# Altium project mbed_main_board.PrjPcb
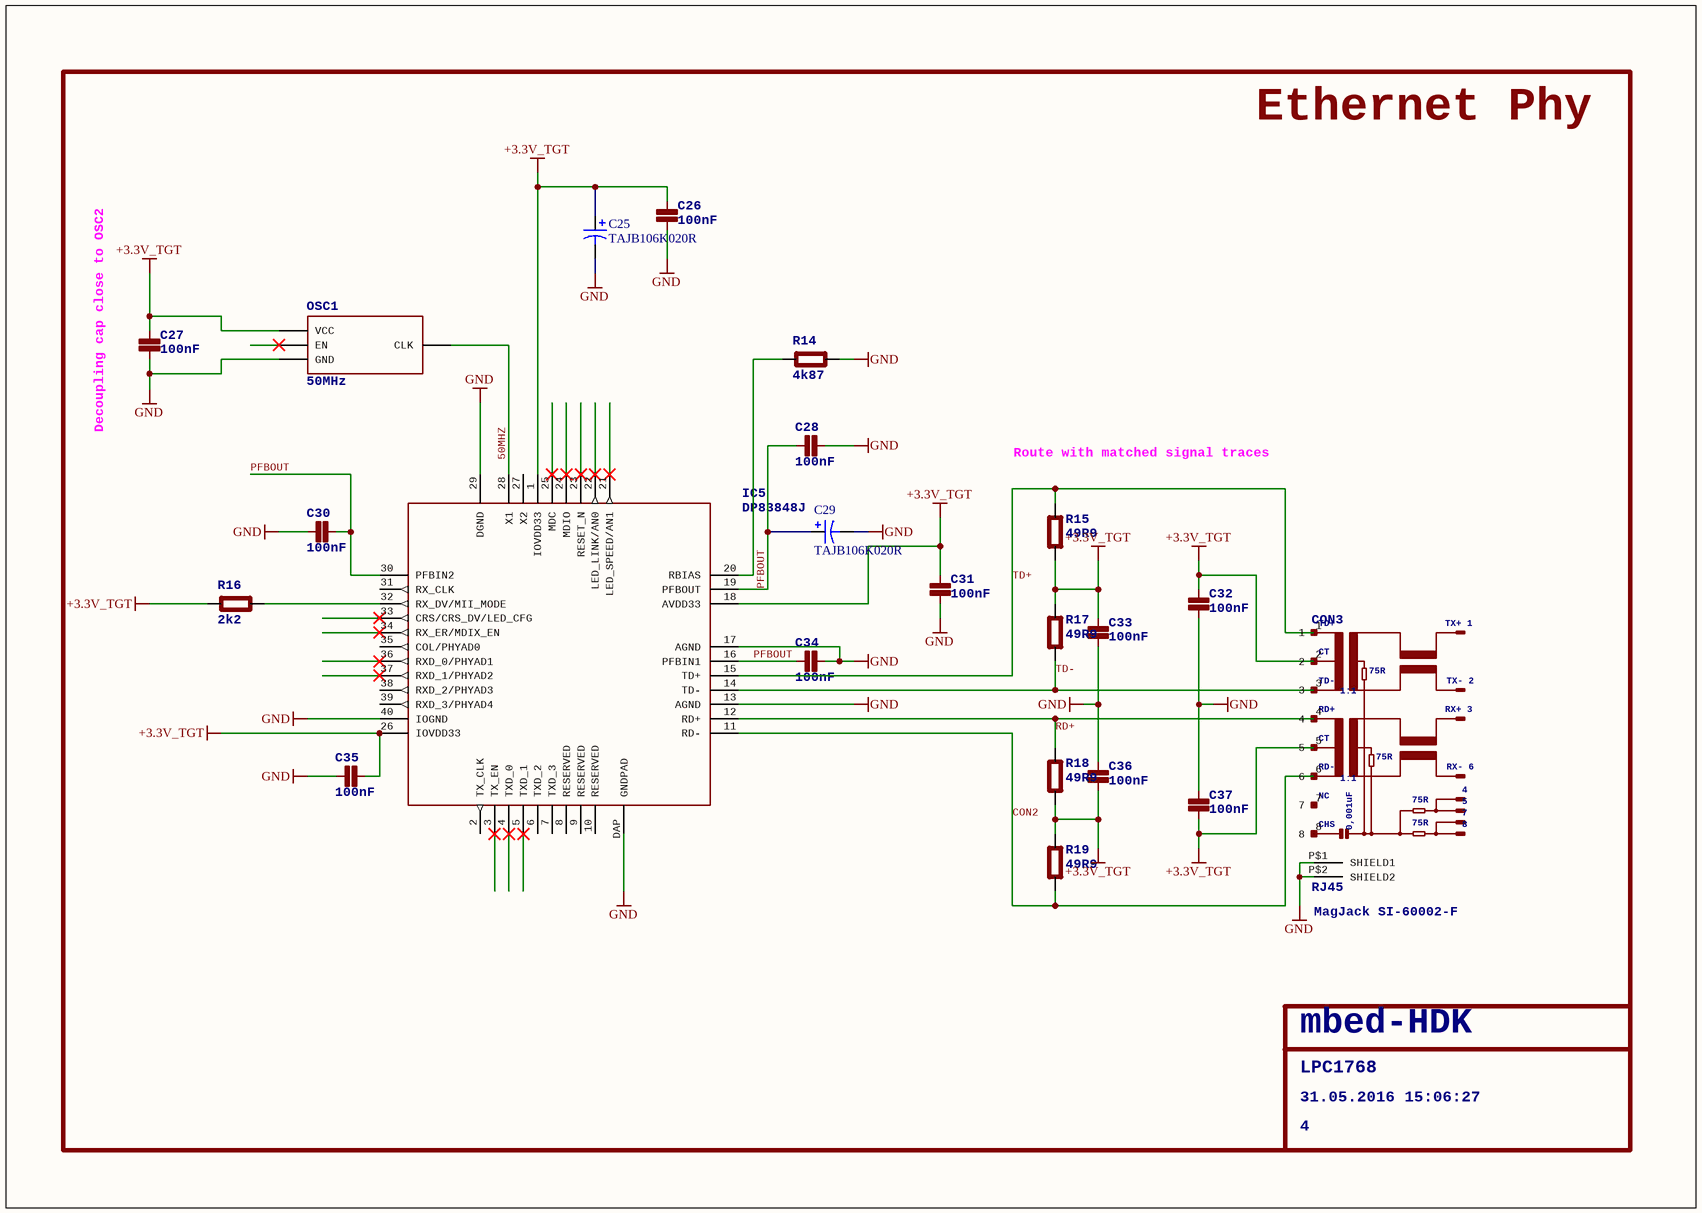
[diagram p0: ethernet_module.SchDoc]
5 sheets, 84 parts. Net scope: global (net labels, ports and power ports of the same name join across sheets).
Sheets:
  ethernet_module.SchDoc
  programming_module.SchDoc
  mbed_main_board.SchDoc
    U_LPC1768 = LPC1768.SchDoc
    U_usb = usb.SchDoc

## Sheet ethernet_module.SchDoc: LPC1768
size 298 x 212 mm; Date: 31.05.2016 15:06:27; SheetNumber: 4

### Parts
C25  TAJB106K020R  [AVX-CAPC3528_V]
C26  100nF  [0603]
C27  100nF  [0603]
C28  100nF  [0603]
C29  TAJB106K020R  [AVX-CAPC3528_V]
C30  100nF  [0603]
C31  100nF  [0603]
C32  100nF  [0603]
C33  100nF  [0603]
C34  100nF  [0603]
C35  100nF  [0603]
C36  100nF  [0603]
C37  100nF  [0603]
CON3  RJ45  RX+3: RX+ 3  TX-2: TX- 2  TX+1: TX+ 1  RX-6: RX- 6  MagJackSI-60002-F: MagJack SI-60002-F  [RJ45]
IC5  DP83848J  [LLP-40]
OSC1  50MHz  [3.2X.2.5]
R14  4k87  [0603]
R15  49R9  [0603]
R16  2k2  [0603]
R17  49R9  [0603]
R18  49R9  [0603]
R19  49R9  [0603]

### Nets
+3.3V_TGT: C25.1 C26.1(P$1) C27.1(P$1) C31.1(P$1) C32.1(P$1) C33.1(P$1) C35.1(P$1) C36.2(P$2) C37.2(P$2) CON3.2 CON3.5 IC5.1(IOVDD33) IC5.18(AVDD33) IC5.26(IOVDD33) OSC1.P$4(VCC) R15.1(P$1) R16.1(P$1) R17.2(P$2) R18.1(P$1) R19.2(P$2)
GND: C25.2 C26.2(P$2) C27.2(P$2) C28.1(P$1) C29.2 C30.1(P$1) C31.2(P$2) C32.2(P$2) C33.2(P$2) C34.2(P$2) C35.2(P$2) C36.1(P$1) C37.1(P$1) CON3.P$1(SHIELD1) CON3.P$2(SHIELD2) IC5.13(AGND) IC5.17(AGND) IC5.29(DGND) IC5.40(IOGND) IC5.DAP(GNDPAD) OSC1.P$2(GND) R14.1(P$1)
50MHZ: IC5.28(X1) OSC1.P$3(CLK)
CON2: CON3.6 IC5.11(RD-) R19.1(P$1)
PFBOUT: C28.2(P$2) C29.1 C30.2(P$2) C34.1(P$1) IC5.16(PFBIN1) IC5.19(PFBOUT) IC5.30(PFBIN2)
RD+: CON3.4 IC5.12(RD+) R18.2(P$2)
TD+: CON3.1 IC5.15(TD+) R15.2(P$2)
TD-: CON3.3 IC5.14(TD-) R17.1(P$1)
NetIC5_20: IC5.20(RBIAS) R14.2(P$2)
NetIC5_32: IC5.32(RX_DV/MII_MODE) R16.2(P$2)

Not connected (* = marked no-connect by the designer): CON3 7 8; IC5 2(TX_CLK) 3(TX_EN)* 4(TXD_0)* 5(TXD_1)* 6(TXD_2) 7(TXD_3) 8(RESERVED) 9(RESERVED) 10(RESERVED) 21(LED_SPEED/AN1)* 22(LED_LINK/AN0)* 23(RESET_N)* 24(MDIO)* 25(MDC)* 27(X2) 31(RX_CLK) 33(CRS/CRS_DV/LED_CFG)* 34(RX_ER/MDIX_EN)* 35(COL/PHYAD0) 36(RXD_0/PHYAD1)* 37(RXD_1/PHYAD2)* 38(RXD_2/PHYAD3) 39(RXD_3/PHYAD4); OSC1 P$1(EN)*

### Notes on the sheet
- Ethernet Phy
- (near C27) Decoupling cap close to OSC2
- (near R15) Route with matched signal traces
- LPC1768
- mbed-HDK
- 31.05.2016 15:06:27
- 4

### Library data of the parts
C25 C29 = CMP-0279-00001-1: Capacitor, Tantalum, 10uF 10% 20V MCCT-B (3528); Manufacturer: AVX; Polarity: Polarized; PartNumber: TAJB106K020R; PackageDescription: 2-Pin SMT Capacitor, 3.5 x 2.8 mm Body; ComponentLink1URL: http://www.avx.com/; PackageReference: CAPC3528; ComponentLink2Description: Datasheet; Capacitance: 10uF; Technology: Tantalum; ComponentLink2URL: http://www.avx.com/docs/Catalogs/taj.pdf; Tolerance: 10%; ComponentLink1Description: Manufacturer URL; Rated Voltage: 20V; DatasheetVersion: Jun-13; Mounting Technology: Surface Mount
C26-C28 C30-C37 = C0603
CON3 = RJ45: Magjack SI-68002; 75R: 75R; TD+: TD+; CT: CT; TD-: TD-; RD+: RD+; RD-: RD-; NC: NC; CHS: CHS; 0,001uF: 0,001uF; 4: 4; 5: 5; 7: 7; 8: 8; 1:1: 1:1
IC5 = DP83848J: National Semiconductor DP83848J PHYTER Mini LS Single Port 10/100 Ethernet Transceiver
OSC1 = OSCILLATOR
R14-R19 = R0603

## Sheet programming_module.SchDoc: LPC1768
size 298 x 212 mm; Date: 31.05.2016 15:06:24; SheetNumber: 1
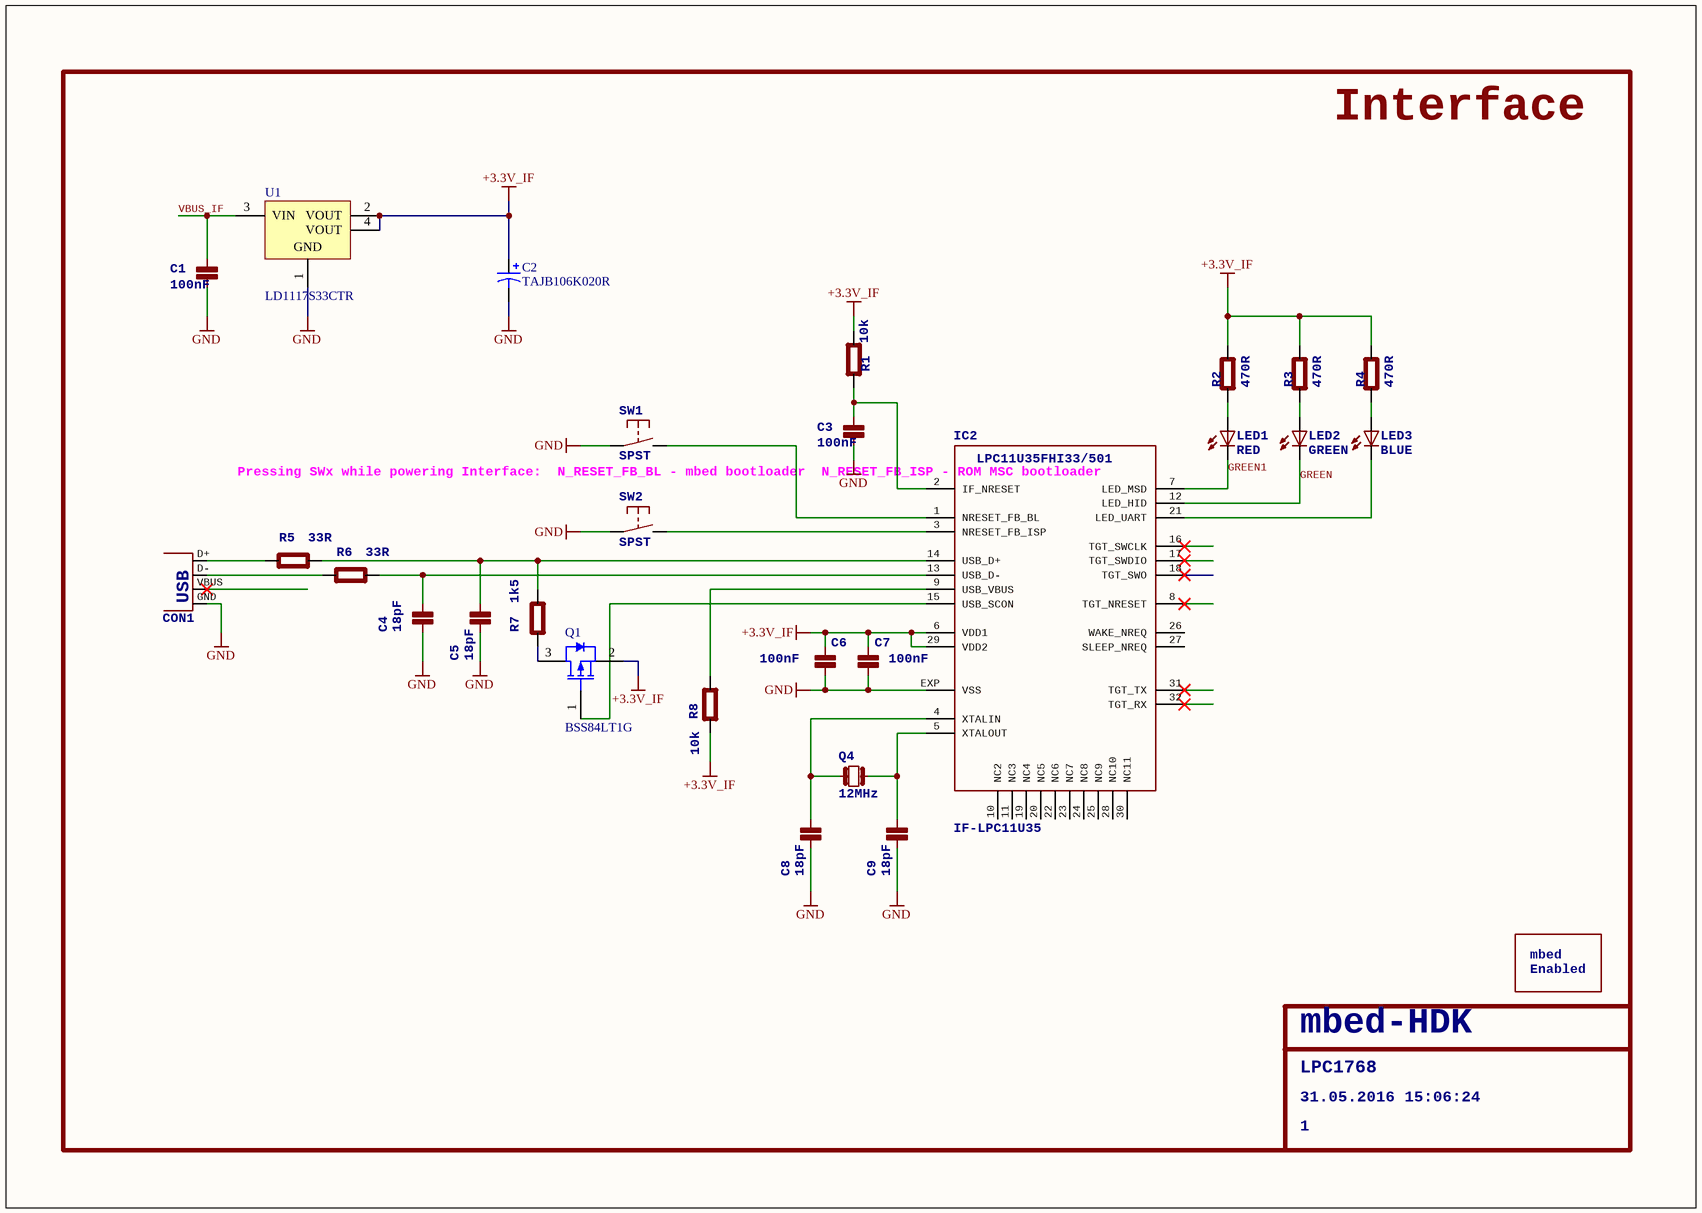
[diagram p1: programming_module.SchDoc]

### Parts
C1  100nF  [0603]
C2  TAJB106K020R  [AVX-CAPC3528_V]
C3  100nF  [0603]
C4  18pF  [0603]
C5  18pF  [0603]
C6  100nF  [0603]
C7  100nF  [0603]
C8  18pF  [0603]
C9  18pF  [0603]
CON1  USB-MB-S  [USB-MB-S]  (value not drawn)
IC2  IF-LPC11U35  [HVQFN33]
LED1  RED  [CHIPLED_0603]
LED2  GREEN  [CHIPLED_0603]
LED3  BLUE  [CHIPLED_0603]
Q1  BSS84LT1G  [ONSC-SOT-23-3-318-08_V]
Q4  12MHz  [HC49UP]
R1  10k  [0603]
R2  470R  [0603]
R3  470R  [0603]
R4  470R  [0603]
R5  33R  [0603]
R6  33R  [0603]
R7  1k5  [0603]
R8  10k  [0603]
SS1  MBED-ENABLED-LOGOMEDIUM  [MBED-ENABLED-LOGO-500X500-MIL]  (value not drawn)
SW1  SPST  [DTSM-32S-B]
SW2  SPST  [DTSM-32S-B]
U1  LD1117S33CTR  [SOT-223_N]

### Nets
+3.3V_IF: C2.1 C6.1(P$1) C7.1(P$1) IC2.6(VDD1) IC2.29(VDD2) Q1.2(S) R1.2(P$2) R2.1(P$1) R3.1(P$1) R4.1(P$1) R8.2(P$2) U1.2(VOUT) U1.4(VOUT)
GND: C1.2(P$2) C2.2 C3.2(P$2) C4.2(P$2) C5.2(P$2) C6.2(P$2) C7.2(P$2) C8.2(P$2) C9.2(P$2) CON1.GND IC2.EXP(VSS) SW1.P$1(P) SW2.P$1(P) U1.1(GND)
GREEN: IC2.12(LED_HID) LED2.C
GREEN1: IC2.7(LED_MSD) LED1.C
VBUS_IF: C1.1(P$1) U1.3(VIN)
NetC3_1: C3.1(P$1) IC2.2(IF_NRESET) R1.1(P$1)
NetC4_1: C4.1(P$1) IC2.13(USB_D-) R6.2(P$2)
NetC5_1: C5.1(P$1) IC2.14(USB_D+) R5.2(P$2) R7.2(P$2)
NetC8_1: C8.1(P$1) IC2.4(XTALIN) Q4.1
NetC9_1: C9.1(P$1) IC2.5(XTALOUT) Q4.2
NetCON1_D+: CON1.D+ R5.1(P$1)
NetCON1_D-: CON1.D- R6.1(P$1)
NetIC2_1: IC2.1(NRESET_FB_BL) SW1.P$2(S)
NetIC2_3: IC2.3(NRESET_FB_ISP) SW2.P$2(S)
NetIC2_9: IC2.9(USB_VBUS) R8.1(P$1)
NetIC2_15: IC2.15(USB_SCON) Q1.1(G)
NetIC2_21: IC2.21(LED_UART) LED3.C
NetLED1_A: LED1.A R2.2(P$2)
NetLED2_A: LED2.A R3.2(P$2)
NetLED3_A: LED3.A R4.2(P$2)
NetQ1_3: Q1.3(D) R7.1(P$1)

Not connected (* = marked no-connect by the designer): CON1 VBUS*; IC2 8(TGT_NRESET)* 10(NC2) 11(NC3) 16(TGT_SWCLK)* 17(TGT_SWDIO)* 18(TGT_SWO)* 19(NC4) 20(NC5) 22(NC6) 23(NC7) 24(NC8) 25(NC9) 26(WAKE_NREQ) 27(SLEEP_NREQ) 28(NC10) 30(NC11) 31(TGT_TX)* 32(TGT_RX)*

### Notes on the sheet
- Interface
- (near IC2) Pressing SWx while powering Interface:
  N_RESET_FB_BL - mbed bootloader
  N_RESET_FB_ISP - ROM MSC bootloader
- LPC1768
- mbed-HDK
- 31.05.2016 15:06:24
- 1

### Library data of the parts
C1 C3-C9 = C0603
C2 = CMP-0279-00001-1: as C25 on sheet ethernet_module; PartNumber: TAJB106K020R; PackageDescription: 2-Pin SMT Capacitor, 3.5 x 2.8 mm Body; ComponentLink1URL: http://www.avx.com/; PackageReference: CAPC3528; ComponentLink2Description: Datasheet; Capacitance: 10uF; Technology: Tantalum; ComponentLink2URL: http://www.avx.com/docs/Catalogs/taj.pdf; Tolerance: 10%; ComponentLink1Description: Manufacturer URL; Rated Voltage: 20V; DatasheetVersion: Jun-13; Mounting Technology: Surface Mount
CON1 = USB-MB-S: USB Connectors; USB: USB
LED1-LED3 = LED0603
Q1 = CMP-1058-00762-1: Power MOSFET Single P-Channel, -50 V, 10 Ohm, 3-Pin SOT-23, Pb-Free, Tape and Reel; Manufacturer: On Semiconductor; Ciss Typ (pF): 36; ID Max (A): 0.13; Channel Polarity: P Channel; VGS(th) Max (V): 2; VGS Max (V): 20; V(BR)DSS Min (V): 50; Crss Typ (pF): 6.5; PD Max (W): 0.225; Coss Typ (pF): 17; Configuration: Single; Mounting Technology: Surface Mount; ComponentLink3URL: http://www.onsemi.cn/pub_link/Collateral/318-08.PDF; ComponentLink1Description: Manufacturer URL; Package Type: SOT-23-3; ComponentLink2URL: http://www.onsemi.com/pub_link/Collateral/BSS84LT1-D.PDF; RoHS: Pb-Free; Packing: Tape and Reel; ComponentLink1URL: http://www.onsemi.com/; PackageVersion: Rev. AP, 11/2009; PackageReference: SOT-23-3-318-08; PackageDescription: 3-Pin Small Outline Transistor, Body 2.92 x 1.3 mm, Pitch 0.95 mm; DatasheetVersion: Rev. 8; ComponentLink3Description: Package Specification; PartNumber: BSS84LT1G; ComponentLink2Description: Datasheet
Q4 = Q_HC49UP
R1-R8 = R0603
U1 = CMP-0244-00307-1: Fixed Low Drop Positive Voltage Regulator, 3.3V, 4-Pin SOT-223, Tape and Reel; ComponentLink1URL: http://www.st.com; PackageVersion: 2010; ComponentLink1Description: Manufacturer URL; DatasheetVersion: 1/11/2011; ComponentLink2URL: http://www.st.com/internet/com/TECHNICAL_RESOURCES/TECHNICAL_LITERATURE/DATASHEET/CD00000544.pdf; PackageReference: SOT-223; ComponentLink2Description: Datasheet; PackageDescription: 4-Pin SOT-223 Package, 6.5 x 3.5 mm Body, 2.3 mm Pitch, 7 mm Lead Span
IC2 = IF-LPC11U35: LPC11U35FHI33/501: LPC11U35FHI33/501
SS1 = MBED-ENABLED-LOGOMEDIUM: mbed: mbed; Enabled: Enabled

## Sheet mbed_main_board.SchDoc
size A4
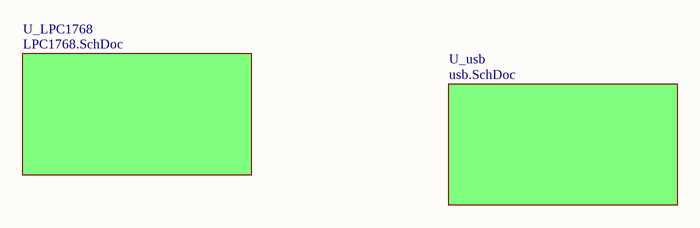
[diagram p2: mbed_main_board.SchDoc]

### Sub-sheets
U_LPC1768 = LPC1768.SchDoc: no entries
U_usb = usb.SchDoc: no entries

## Sheet LPC1768.SchDoc: LPC1768
size 298 x 212 mm; Date: 31.05.2016 15:06:25; SheetNumber: 2
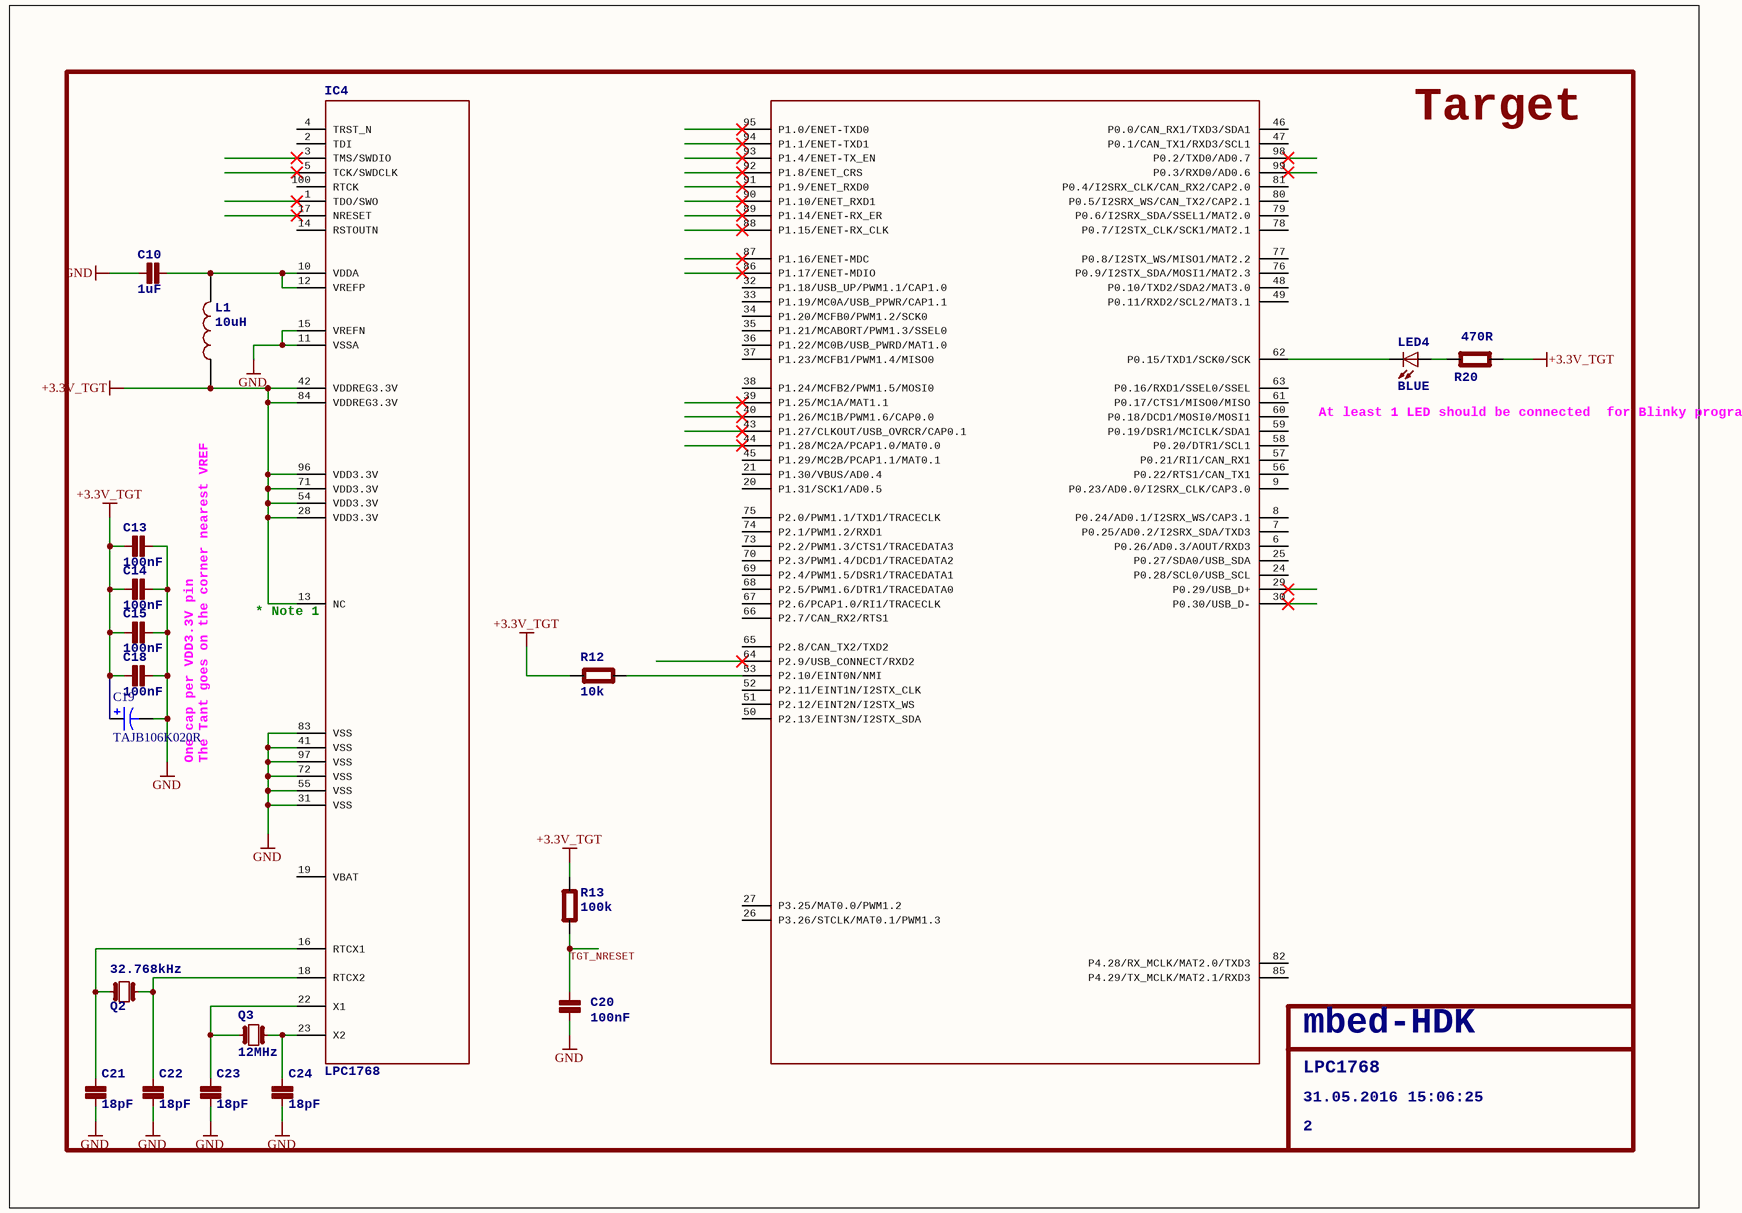
[diagram p3: LPC1768.SchDoc]

### Parts
C10  1uF  [0603]
C13  100nF  [0603]
C14  100nF  [0603]
C15  100nF  [0603]
C18  100nF  [0603]
C19  TAJB106K020R  [AVX-CAPC3528_V]
C20  100nF  [0603]
C21  18pF  [0603]
C22  18pF  [0603]
C23  18pF  [0603]
C24  18pF  [0603]
IC4  LPC1768  [LQFP100]
L1  10uH  [0603]
LED4  BLUE  [CHIPLED_0603]
Q2  32.768kHz  [FC135]
Q3  12MHz  [HC49UP]
R12  10k  [0603]
R13  100k  [0603]
R20  470R  [0603]

### Nets
+3.3V_TGT: C13.1(P$1) C14.1(P$1) C15.1(P$1) C18.1(P$1) C19.1 IC4.13(NC) IC4.28(VDD3.3V) IC4.42(VDDREG3.3V) IC4.54(VDD3.3V) IC4.71(VDD3.3V) IC4.84(VDDREG3.3V) IC4.96(VDD3.3V) L1.1(P$1) R12.1(P$1) R13.2(P$2) R20.1(P$1)
GND: C10.2(P$2) C13.2(P$2) C14.2(P$2) C15.2(P$2) C18.2(P$2) C19.2 C20.1(P$1) C21.1(P$1) C22.1(P$1) C23.1(P$1) C24.1(P$1) IC4.11(VSSA) IC4.15(VREFN) IC4.31(VSS) IC4.41(VSS) IC4.55(VSS) IC4.72(VSS) IC4.83(VSS) IC4.97(VSS)
TGT_NRESET: C20.2(P$2) R13.1(P$1)
NetC10_1: C10.1(P$1) IC4.10(VDDA) IC4.12(VREFP) L1.2(P$2)
NetC21_2: C21.2(P$2) IC4.16(RTCX1) Q2.X2
NetC22_2: C22.2(P$2) IC4.18(RTCX2) Q2.X1
NetC23_2: C23.2(P$2) IC4.22(X1) Q3.1
NetC24_2: C24.2(P$2) IC4.23(X2) Q3.2
NetIC4_53: IC4.53(P2.10/EINT0N/NMI) R12.2(P$2)
NetIC4_62: IC4.62(P0.15/TXD1/SCK0/SCK) LED4.C
NetLED4_A: LED4.A R20.2(P$2)

Not connected (* = marked no-connect by the designer): IC4 1(TDO/SWO)* 2(TDI) 3(TMS/SWDIO)* 4(TRST_N) 5(TCK/SWDCLK)* 6(P0.26/AD0.3/AOUT/RXD3) 7(P0.25/AD0.2/I2SRX_SDA/TXD3) 8(P0.24/AD0.1/I2SRX_WS/CAP3.1) 9(P0.23/AD0.0/I2SRX_CLK/CAP3.0) 14(RSTOUTN) 17(NRESET)* 19(VBAT) 20(P1.31/SCK1/AD0.5) 21(P1.30/VBUS/AD0.4) 24(P0.28/SCL0/USB_SCL) 25(P0.27/SDA0/USB_SDA) 26(P3.26/STCLK/MAT0.1/PWM1.3) 27(P3.25/MAT0.0/PWM1.2) 29(P0.29/USB_D+)* 30(P0.30/USB_D-)* 32(P1.18/USB_UP/PWM1.1/CAP1.0) 33(P1.19/MC0A/USB_PPWR/CAP1.1) 34(P1.20/MCFB0/PWM1.2/SCK0) 35(P1.21/MCABORT/PWM1.3/SSEL0) 36(P1.22/MC0B/USB_PWRD/MAT1.0) 37(P1.23/MCFB1/PWM1.4/MISO0) 38(P1.24/MCFB2/PWM1.5/MOSI0) 39(P1.25/MC1A/MAT1.1)* 40(P1.26/MC1B/PWM1.6/CAP0.0)* 43(P1.27/CLKOUT/USB_OVRCR/CAP0.1)* 44(P1.28/MC2A/PCAP1.0/MAT0.0)* 45(P1.29/MC2B/PCAP1.1/MAT0.1) 46(P0.0/CAN_RX1/TXD3/SDA1) 47(P0.1/CAN_TX1/RXD3/SCL1) 48(P0.10/TXD2/SDA2/MAT3.0) 49(P0.11/RXD2/SCL2/MAT3.1) 50(P2.13/EINT3N/I2STX_SDA) 51(P2.12/EINT2N/I2STX_WS) 52(P2.11/EINT1N/I2STX_CLK) 56(P0.22/RTS1/CAN_TX1) 57(P0.21/RI1/CAN_RX1) 58(P0.20/DTR1/SCL1) 59(P0.19/DSR1/MCICLK/SDA1) 60(P0.18/DCD1/MOSI0/MOSI1) 61(P0.17/CTS1/MISO0/MISO) 63(P0.16/RXD1/SSEL0/SSEL) 64(P2.9/USB_CONNECT/RXD2)* 65(P2.8/CAN_TX2/TXD2) 66(P2.7/CAN_RX2/RTS1) 67(P2.6/PCAP1.0/RI1/TRACECLK) 68(P2.5/PWM1.6/DTR1/TRACEDATA0) 69(P2.4/PWM1.5/DSR1/TRACEDATA1) 70(P2.3/PWM1.4/DCD1/TRACEDATA2) 73(P2.2/PWM1.3/CTS1/TRACEDATA3) 74(P2.1/PWM1.2/RXD1) 75(P2.0/PWM1.1/TXD1/TRACECLK) 76(P0.9/I2STX_SDA/MOSI1/MAT2.3) 77(P0.8/I2STX_WS/MISO1/MAT2.2) 78(P0.7/I2STX_CLK/SCK1/MAT2.1) 79(P0.6/I2SRX_SDA/SSEL1/MAT2.0) 80(P0.5/I2SRX_WS/CAN_TX2/CAP2.1) 81(P0.4/I2SRX_CLK/CAN_RX2/CAP2.0) 82(P4.28/RX_MCLK/MAT2.0/TXD3) 85(P4.29/TX_MCLK/MAT2.1/RXD3) 86(P1.17/ENET-MDIO)* 87(P1.16/ENET-MDC)* 88(P1.15/ENET-RX_CLK)* 89(P1.14/ENET-RX_ER)* 90(P1.10/ENET_RXD1)* 91(P1.9/ENET_RXD0)* 92(P1.8/ENET_CRS)* 93(P1.4/ENET-TX_EN)* 94(P1.1/ENET-TXD1)* 95(P1.0/ENET-TXD0)* 98(P0.2/TXD0/AD0.7)* 99(P0.3/RXD0/AD0.6)* 100(RTCK)

### Notes on the sheet
- Target
- At least 1 LED should be connected
  for Blinky programs
- (near IC4) * Note 1
- One cap per VDD3.3V pin
- The Tant goes on the corner nearest VREF
- (near IC4) LPC1768
- (near IC4) mbed-HDK
- 31.05.2016 15:06:25
- 2

### Library data of the parts
C10 C13-C15 C18 C20-C24 = C0603
C19 = CMP-0279-00001-1: as C25 on sheet ethernet_module; PartNumber: TAJB106K020R; PackageDescription: 2-Pin SMT Capacitor, 3.5 x 2.8 mm Body; ComponentLink1URL: http://www.avx.com/; PackageReference: CAPC3528; ComponentLink2Description: Datasheet; Capacitance: 10uF; Technology: Tantalum; ComponentLink2URL: http://www.avx.com/docs/Catalogs/taj.pdf; Tolerance: 10%; ComponentLink1Description: Manufacturer URL; Rated Voltage: 20V; DatasheetVersion: Jun-13; Mounting Technology: Surface Mount
L1 = L
LED4 = LED0603
Q2 = Q_FC135
Q3 = Q_HC49UP
R12 R13 R20 = R0603

## Sheet usb.SchDoc: LPC1768
size 298 x 212 mm; Date: 31.05.2016 15:06:26; SheetNumber: 3
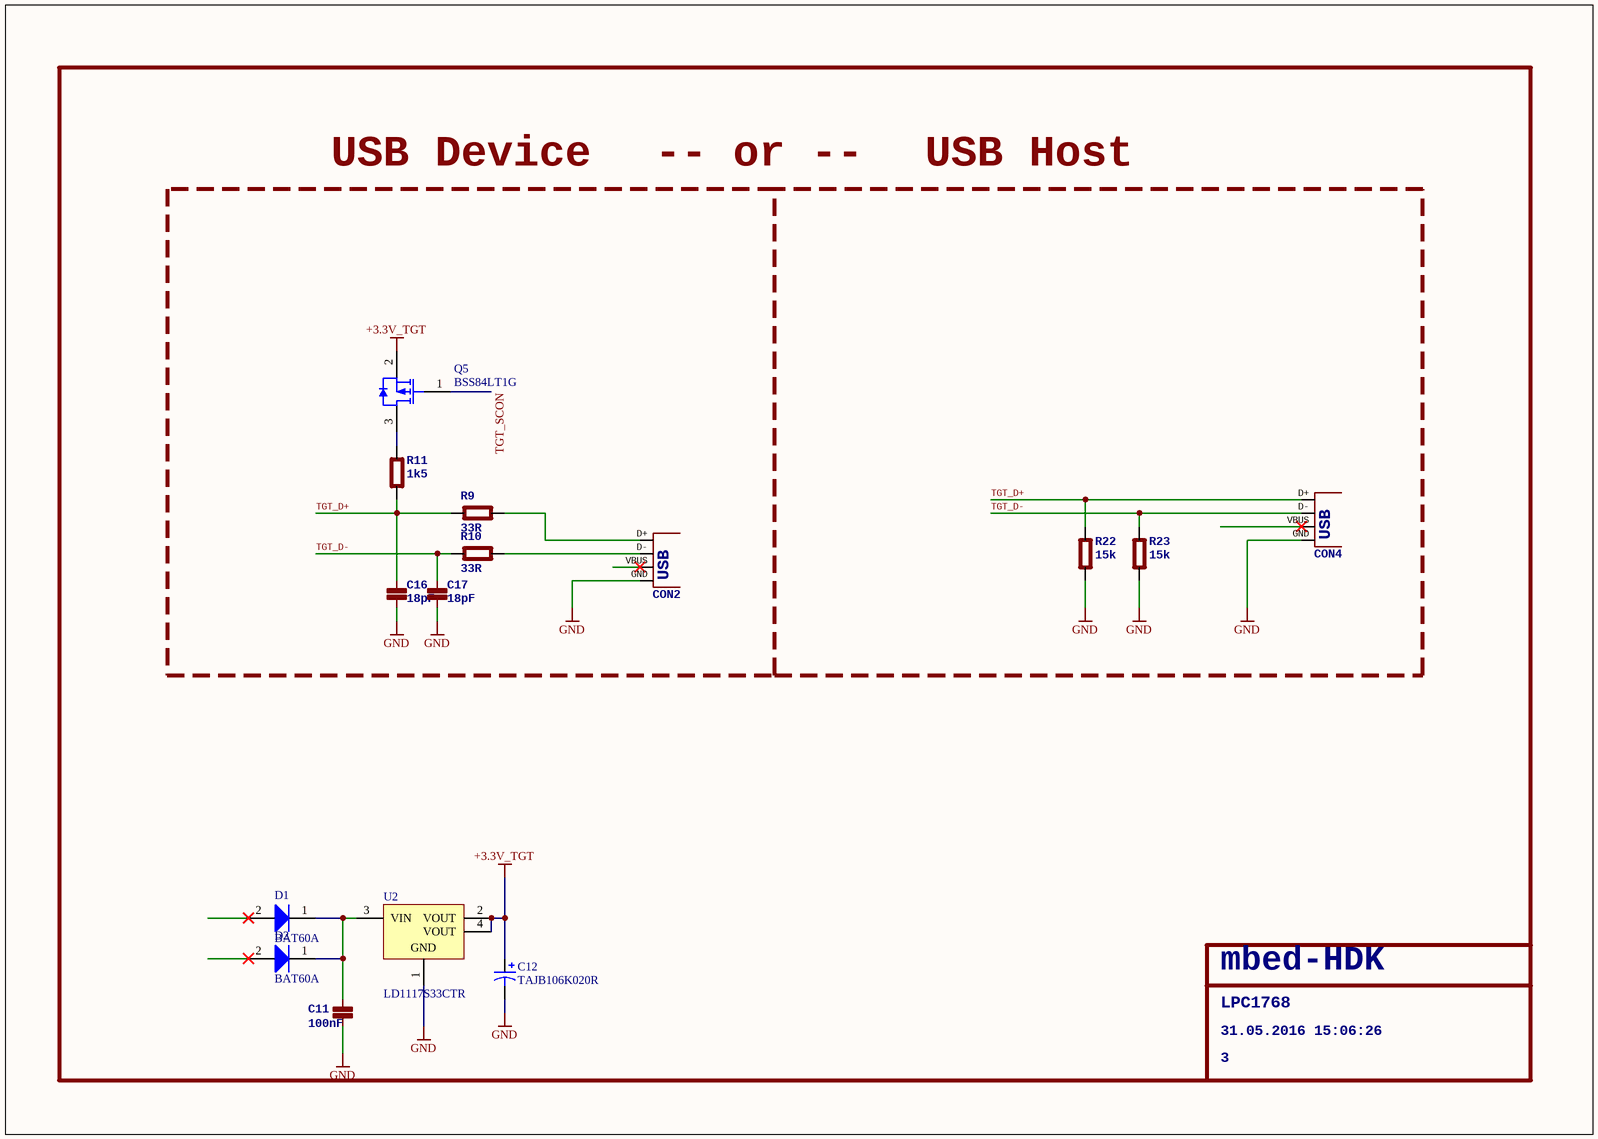
[diagram p4: usb.SchDoc]

### Parts
C11  100nF  [0603]
C12  TAJB106K020R  [AVX-CAPC3528_V]
C16  18pF  [0603]
C17  18pF  [0603]
CON2  USB-MB-S  [USB-MB-S]  (value not drawn)
CON4  USB-A-H  [USB-A-H]  (value not drawn)
D1  BAT60A  [INF-SOD323_V]
D2  BAT60A  [INF-SOD323_V]
Q5  BSS84LT1G  [ONSC-SOT-23-3-318-08_V]
R9  33R  [0603]
R10  33R  [0603]
R11  1k5  [0603]
R22  15k  [0603]
R23  15k  [0603]
U2  LD1117S33CTR  [SOT-223_N]

### Nets
+3.3V_TGT: C12.1 Q5.2(S) U2.2(VOUT) U2.4(VOUT)
GND: C11.2(P$2) C12.2 C16.2(P$2) C17.2(P$2) CON2.GND CON4.GND R22.1(P$1) R23.1(P$1) U2.1(GND)
TGT_D+: C16.1(P$1) CON4.D+ R9.1(P$1) R11.2(P$2) R22.2(P$2)
TGT_D-: C17.1(P$1) CON4.D- R10.1(P$1) R23.2(P$2)
TGT_SCON: Q5.1(G)
NetC11_1: C11.1(P$1) D1.1(K) D2.1(K) U2.3(VIN)
NetCON2_D+: CON2.D+ R9.2(P$2)
NetCON2_D-: CON2.D- R10.2(P$2)
NetQ5_3: Q5.3(D) R11.1(P$1)

Not connected (* = marked no-connect by the designer): CON2 VBUS*; CON4 VBUS*; D1 2(A)*; D2 2(A)*

### Notes on the sheet
- USB Device
- -- or --
- USB Host
- LPC1768
- mbed-HDK
- 31.05.2016 15:06:26
- 3

### Library data of the parts
C11 C16 C17 = C0603
C12 = CMP-0279-00001-1: as C25 on sheet ethernet_module; PartNumber: TAJB106K020R; PackageDescription: 2-Pin SMT Capacitor, 3.5 x 2.8 mm Body; ComponentLink1URL: http://www.avx.com/; PackageReference: CAPC3528; ComponentLink2Description: Datasheet; Capacitance: 10uF; Technology: Tantalum; ComponentLink2URL: http://www.avx.com/docs/Catalogs/taj.pdf; Tolerance: 10%; ComponentLink1Description: Manufacturer URL; Rated Voltage: 20V; DatasheetVersion: Jun-13; Mounting Technology: Surface Mount
CON2 = USB-MB-S: USB Connectors; USB: USB
CON4 = USB-A-H: USB Connectors; USB: USB
D1 D2 = CMP-1183-00008-2: Silicon Schottky Diode, -55 to 85 degC, SOD323, Reel, Green; Manufacturer: Infineon; Green: TRUE; VR (max): 10Â V; IF (max): 3,000Â mA; VF (max): 370Â mV; CT (max): 35Â pF; Configuration: Single; PackageDescription: 3-Pin Small Outline Transistor Package, 1.25 x 2 mm Body, 0.65 mm Pitch; PartNumber: BAT60A; Mounting Technology: Surface Mount; PackageReference: SOT323; ComponentLink1Description: Manufacturer URL; Packing: Reel; ComponentLink3URL: http://www.infineon.com/dgdl/SOT323-Package_Overview.pdf?folderId=db3a30431936bc4b0119533e1dcb3c92&fileId=db3a30431936bc4b011953495f283cb1; ComponentLink2URL: http://www.infineon.com/dgdl/bat60aseries.pdf?folderId=db3a304313d846880113def5812204a1&fileId=db3a304313d846880113def70c9304a9; ComponentLink1URL: http://www.infineon.com/; ComponentLink2Description: Datasheet; ComponentLink3Description: Package Specification
Q5 = CMP-1058-00762-1: as Q1 on sheet programming_module; Configuration: Single; Mounting Technology: Surface Mount; ComponentLink3URL: http://www.onsemi.cn/pub_link/Collateral/318-08.PDF; ComponentLink1Description: Manufacturer URL; Package Type: SOT-23-3; ComponentLink2URL: http://www.onsemi.com/pub_link/Collateral/BSS84LT1-D.PDF; RoHS: Pb-Free; Packing: Tape and Reel; ComponentLink1URL: http://www.onsemi.com/; PackageVersion: Rev. AP, 11/2009; PackageReference: SOT-23-3-318-08; PackageDescription: 3-Pin Small Outline Transistor, Body 2.92 x 1.3 mm, Pitch 0.95 mm; DatasheetVersion: Rev. 8; ComponentLink3Description: Package Specification; PartNumber: BSS84LT1G; ComponentLink2Description: Datasheet
R9-R11 R22 R23 = R0603
U2 = CMP-0244-00307-1: as U1 on sheet programming_module; ComponentLink1URL: http://www.st.com; PackageVersion: 2010; ComponentLink1Description: Manufacturer URL; DatasheetVersion: 1/11/2011; ComponentLink2URL: http://www.st.com/internet/com/TECHNICAL_RESOURCES/TECHNICAL_LITERATURE/DATASHEET/CD00000544.pdf; PackageReference: SOT-223; ComponentLink2Description: Datasheet; PackageDescription: 4-Pin SOT-223 Package, 6.5 x 3.5 mm Body, 2.3 mm Pitch, 7 mm Lead Span

## Nets that join several sheets
+3.3V_TGT: ethernet_module (20 pins), LPC1768 (16 pins), usb (C12.1 Q5.2 U2.2 U2.4)
GND: ethernet_module (22 pins), programming_module (14 pins), LPC1768 (19 pins), usb (9 pins)